# EAGLE design net-stepper2 (EAGLE 8.6.0)
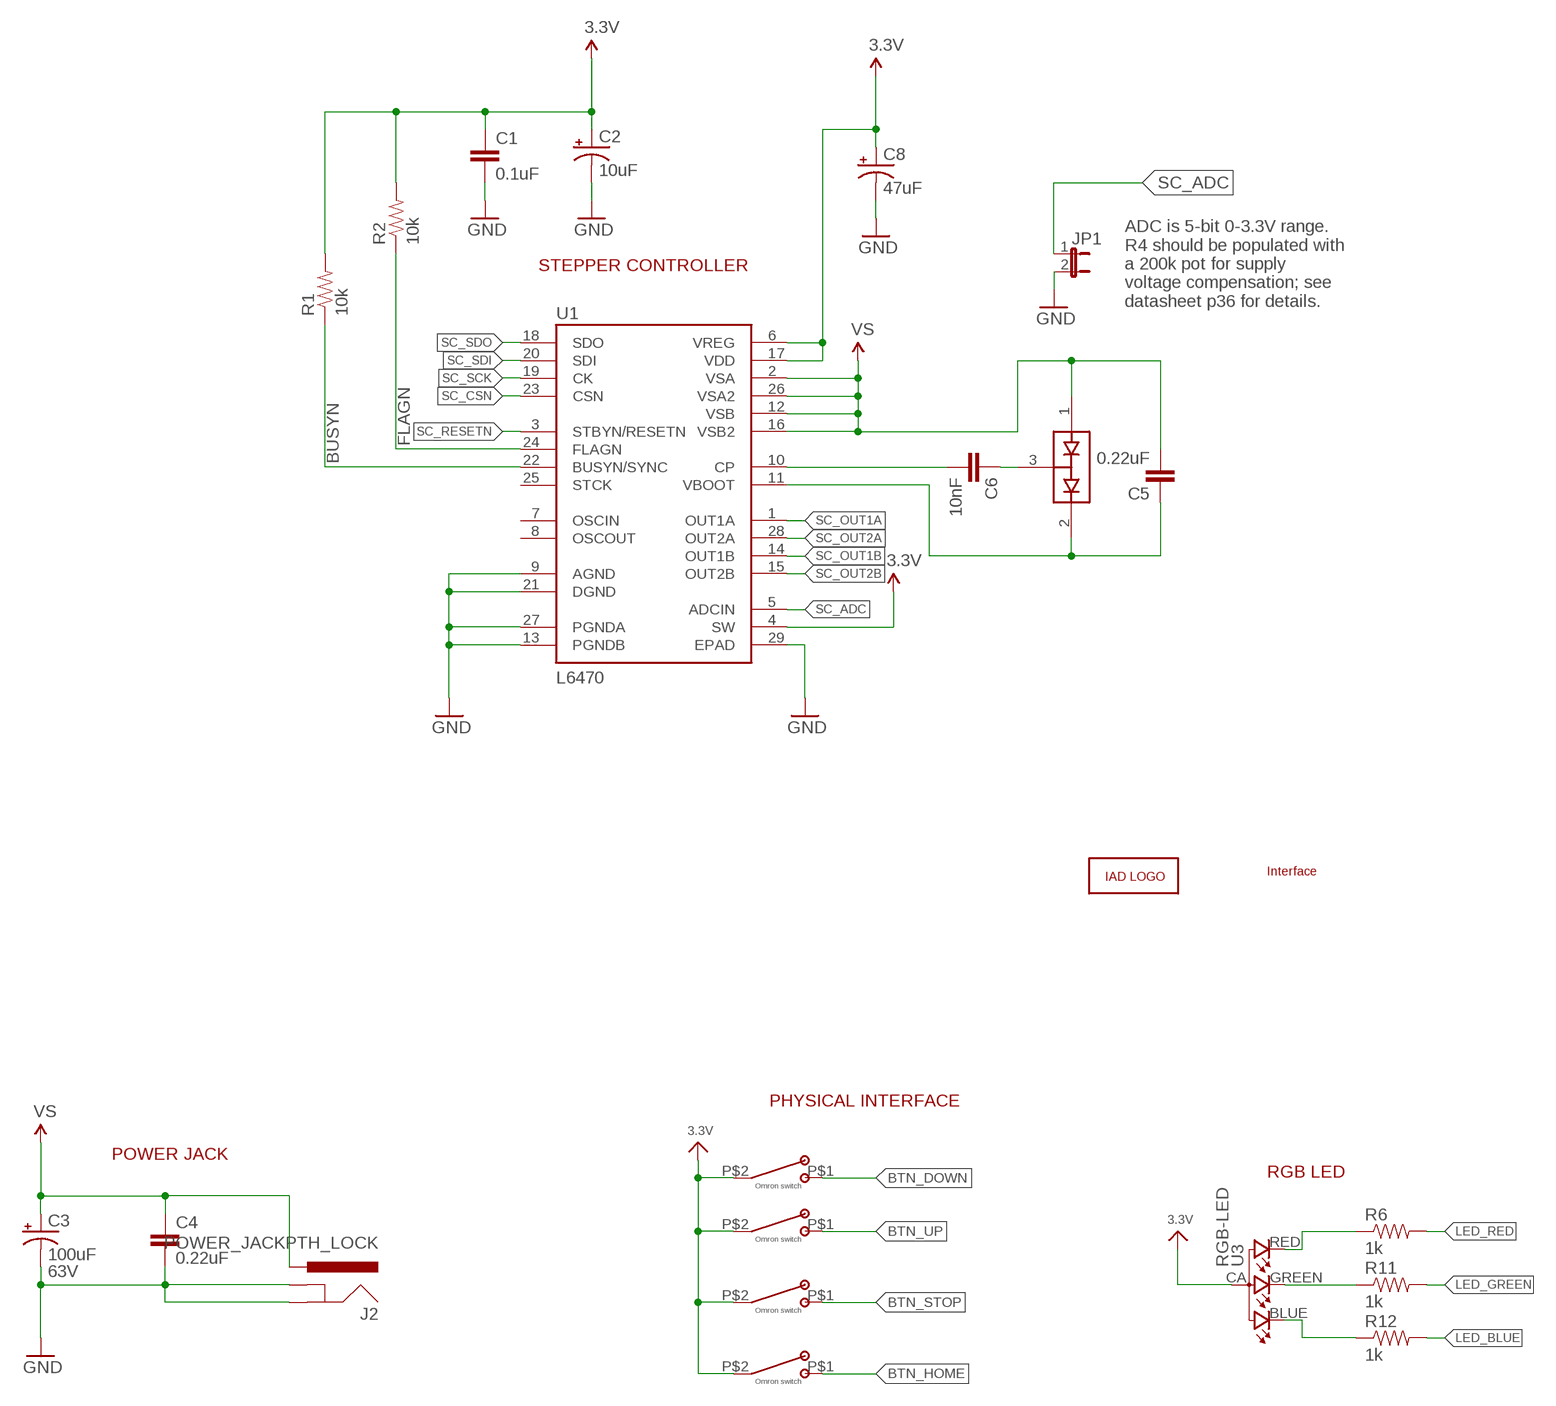
[diagram p0: schematic, sheet 1, part 1 of 2]
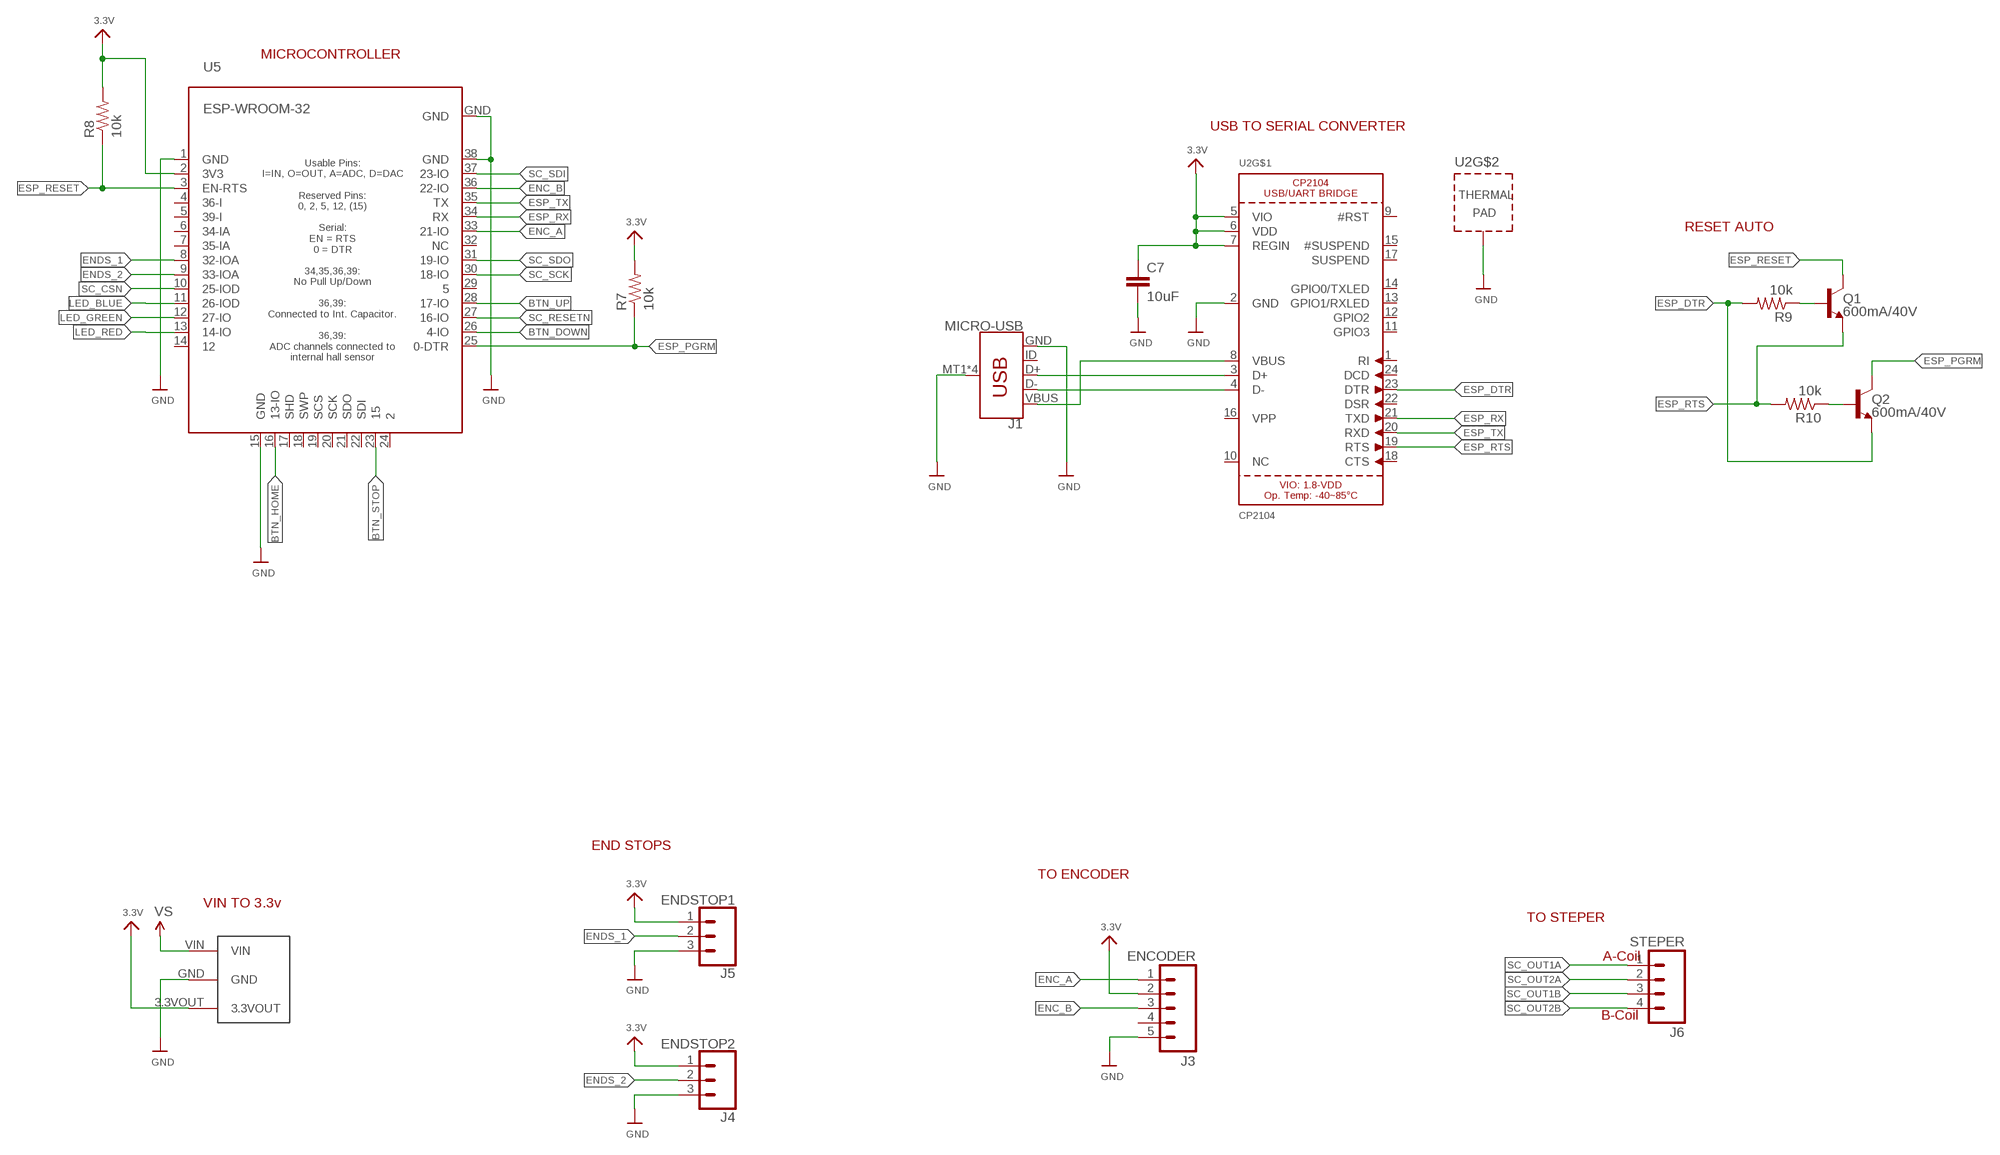
[diagram p1: schematic, sheet 1, part 2 of 2]

## Parts
A1  ZHDK_LOGO_METAL  [ZHDK_LOGO]
A2  INTERFACE_NETSTEPPER  [INTERFACE_NETSTEPPER]
C1  0.1uF  CAP0603-CAP  [0603-CAP]
C2  10uF  10UF-TANT  [EIA3216]
C3  100uF  100UF-63V-20%(ELECT)  [NIC_10X10.5_CAP]
C4  0.22uF  CAP0603-CAP  [0603-CAP]
C5  0.22uF  CAP0603-CAP  [0603-CAP]
C6  10nF  10NF/10000PF-50V-10%(0603)  [0603-CAP]
C7  10uF  10UF-0603-6.3V-20%  [0603]
C8  47uF  47UF-TANT  [EIA3528]
D1  BAV99  [SOT23-3@1]
J1  MICRO-USB  USB_MICRO-B_SMT  [USB-MICROB]
J2  POWER_JACKPTH_LOCK  [POWER_JACK_PTH_LOCK]
J3  ENCODER  M05PTH  [1X05]
J4  ENDSTOP2  CONN_03  [1X03]
J5  ENDSTOP1  CONN_03  [1X03]
J6  STEPER  M04LOCK_LONGPADS  [1X04_LOCK_LONGPADS]
JP1  JUMPER-2SMD-NC  [SJ_2S]
Q1  600mA/40V  TRANS_NPN-MMBT2222AL  [SOT23-3]
Q2  600mA/40V  TRANS_NPN-MMBT2222AL  [SOT23-3]
R1  10k  RESISTOR0603-RES  [0603-RES]
R2  10k  RESISTOR0603-RES  [0603-RES]
R6  1k  RESISTOR0603-RES  [0603-RES]
R7  10k  RESISTOR0603-RES  [0603-RES]
R8  10k  RESISTOR0603-RES  [0603-RES]
R9  10k  RESISTOR0603-RES  [0603-RES]
R10  10k  RESISTOR0603-RES  [0603-RES]
R11  1k  RESISTOR0603-RES  [0603-RES]
R12  1k  RESISTOR0603-RES  [0603-RES]
S1  B3AL-1002P-MS  [B3AL-1002P-MS]
S2  B3AL-1002P-MS  [B3AL-1002P-MS]
S3  B3AL-1002P-MS  [B3AL-1002P-MS]
S4  B3AL-1002P-MS  [B3AL-1002P-MS]
U1  L6470  L6470  [HTSSOP28]
U2  CP2104  [QFN24_4MM_SMSC]
U3  RGB-LED  RGB-LED-CLMVB-FKARGB  [PLCC4-2MM-RGB]
U4  TRACO12433  [TRACO12433]
U5  ESP-WROOM-32  [ESP-WROOM-32]

## Nets
3.3V: C1.1 C2.A(+) C7.1 C8.A(+) J3.2 J4.1 J5.1 R1.2 R2.2 R7.2 R8.2 S1.P$2 S2.P$2 S3.P$2 S4.P$2 U1.4(SW) U1.6(VREG) U1.17(VDD) U2.5(VIO) U2.6(VDD) U2.7(REGIN) U3.CA U4.3.3VOUT U5.2(3V3)
BTN_DOWN: S1.P$1 U5.26(4-IO)
BTN_HOME: S4.P$1 U5.16(13-IO)
BTN_STOP: S3.P$1 U5.23
BTN_UP: S2.P$1 U5.28(17-IO)
BUSYN: R1.1 U1.22(BUSYN/SYNC)
CP_HIGH: C6.1 D1.3(COM)
ENC_A: J3.1 U5.33(21-IO)
ENC_B: J3.3 U5.36(22-IO)
ENDS_1: J5.2 U5.8(32-IOA)
ENDS_2: J4.2 U5.9(33-IOA)
ESP_DTR: Q2.2(E) R9.2 U2.23(DTR)
ESP_PGRM: Q2.3(C) R7.1 U5.25(0-DTR)
ESP_RESET: Q1.3(C) R8.1 U5.3(EN-RTS)
ESP_RTS: Q1.2(E) R10.2 U2.19(RTS)
ESP_RX: U2.21(TXD) U5.34(RX)
ESP_TX: U2.20(RXD) U5.35(TX)
FLAGN: R2.1 U1.24(FLAGN)
GND: C1.2 C2.C(-) C3.- C4.2 C7.2 C8.C(-) J1.GND J1.MT1(SHIELD) J1.MT2(SHIELD) J1.P$1(SHIELD) J1.P$2(SHIELD) J2.GND J2.GNDBREAK J3.5 J4.3 J5.3 JP1.2 U1.9(AGND) U1.13(PGNDB) U1.21(DGND) U1.27(PGNDA) U1.29(EPAD) U2.2(GND) U2.THERM(TP) U4.GND U5.1(GND) U5.15(GND) U5.38(GND) U5.GND
LED_BLUE: R12.2 U5.11(26-IOD)
LED_GREEN: R11.2 U5.12(27-IO)
LED_RED: R6.2 U5.13(14-IO)
N$1: J1.VBUS U2.8(VBUS)
N$11: R11.1 U3.GREEN
N$12: R6.1 U3.RED
N$13: J1.D+ U2.3(D+)
N$14: J1.D- U2.4(D-)
N$20: R12.1 U3.BLUE
N$22: Q1.1(B) R9.1
N$23: Q2.1(B) R10.1
SC_ADC: JP1.1 U1.5(ADCIN)
SC_CSN: U1.23(CSN) U5.10(25-IOD)
SC_OUT1A: J6.1 U1.1(OUT1A)
SC_OUT1B: J6.3 U1.14(OUT1B)
SC_OUT2A: J6.2 U1.28(OUT2A)
SC_OUT2B: J6.4 U1.15(OUT2B)
SC_RESETN: U1.3(STBYN/RESETN) U5.27(16-IO)
SC_SCK: U1.19(CK) U5.30(18-IO)
SC_SDI: U1.20(SDI) U5.37(23-IO)
SC_SDO: U1.18(SDO) U5.31(19-IO)
V_BOOT: C5.1 D1.2(C2) U1.11(VBOOT)
V_CP: C6.2 U1.10(CP)
VS: C3.+ C4.1 C5.2 D1.1(A1) J2.PWR U1.2(VSA) U1.12(VSB) U1.16(VSB2) U1.26(VSA2) U4.VIN
Unconnected: J1.ID J3.4 U1.7(OSCIN) U1.8(OSCOUT) U1.25(STCK) U2.1(RI) U2.9(#RST) U2.10(NC) U2.11(GPIO3) U2.12(GPIO2) U2.13(GPIO1/RXLED) U2.14(GPIO0/TXLED) U2.15(#SUSPEND) U2.16(VPP) U2.17(SUSPEND) U2.18(CTS) U2.22(DSR) U2.24(DCD) U5.4(36-I) U5.5(39-I) U5.6(34-IA) U5.7(35-IA) U5.14 U5.17(SHD) U5.18(SWP) U5.19(SCS) U5.20(SCK) U5.21(SDO) U5.22(SDI) U5.24 U5.29 U5.32(NC)

## Notes on the sheet
- FIX: External power requirement to flash the device. Actually, the esp32 is powered somehow through the usb bridge...
- MICROCONTROLLER
- USB TO SERIAL CONVERTER
- STEPPER CONTROLLER
- ADC is 5-bit 0-3.3V range.
  R4 should be populated with
  a 200k pot for supply
  voltage compensation; see
  datasheet p36 for details.
- RESET AUTO
- PHYSICAL INTERFACE
- END STOPS
- POWER JACK
- RGB LED | TO ENCODER
- VIN TO 3.3v
- TO STEPER
- 63V | A-Coil
- B-Coil

## Library data of the parts
A1 = IAD_GRAPHIC:ZHDK_LOGO_METAL
A2 = IAD_GRAPHIC:INTERFACE_NETSTEPPER
C1 C4 C5 = SparkFun-Passives:CAP: Capacitor Standard 0603 ceramic capacitor, and 0.1" leaded capacitor.
C2 = SparkFun-Capacitors:10UF-TANT: 10uF Tantalum SMT CAP-00811- 16V 10% (EIA-3216); PROD_ID: CAP-00811
C3 = SparkFun-Capacitors:100UF-63V-20%(ELECT): CAP-08362 100uF electrolytic SMT 63V 20%; PROD_ID: CAP-08362
C6 = SparkFun-Capacitors:10NF/10000PF-50V-10%(0603): CAP-00867; PROD_ID: CAP-00867
C7 = SparkFun-Capacitors:10UF: 10.0µF ceramic capacitors A capacitor is a passive two-terminal electrical component used to store electrical energy temporarily in an electric field.; PROD_ID: CAP-11015
C8 = SparkFun-Capacitors:47UF-TANT: 47uF Tantalum SMT CAP-08310- 10V 10% (EIA-3528); PROD_ID: CAP-08310
D1 = SparkFun-DiscreteSemi:BAV99: Two small signal silicon diodes connected anode to cathode. Connections to all three nodes available. DIO-10647; PROD_ID: DIO-10647
J1 = SparkFun-Connectors:USB_MICRO-B: USB Type Micro-B Connector Male/female and PTH/SMT variants SparkFun Products: SparkFun microB USB Breakout <https://www.sparkfun.com/products/12035> SparkFun USB microB Plug Breakout <https://www.sparkfun.com/products/10031> SparkFun ESP8266 Thing <https://www.sparkfun.com/products/13231>; PROD_ID: CONN-09505; SF_ID: PRT-08533
J2 = SparkFun-Connectors:POWER_JACK: Power Jack This is the standard 5.5mm barrel jack for power. The PTH is the most common, proven, reliable, footprint. The Slot footprint only works if the mill layer is transmitted to the PCB fab house so be warned. Mating wall wart : TOL-00298 (and others); PROD_ID: CONN-08197; SF_ID: PRT-00119
J3 = SparkFun-Connectors:M05: Header 5 Standard 5-pin 0.1" header. Use with straight break away headers (SKU : PRT-00116), right angle break away headers (PRT-00553), swiss pins (PRT-00743), machine pins (PRT-00117), and female headers (PRT-00115). Molex polarized connector foot print use with SKU : PRT-08230 with associated crimp pins and housings.
J4 J5 = SparkFun-Connectors:CONN_03: Multi connection point. Often used as Generic Header-pin footprint for 0.1 inch spaced/style header connections On any of the 0.1 inch spaced packages, you can populate with these: Break Away Headers - Straight <https://www.sparkfun.com/products/116> (PRT-00116) Break Away Male Headers - Right Angle <https://www.sparkfun.com/products/553> (PRT-00553) Female Headers <https://www.sparkfun.com/products/115> (PRT-00115) Break Away Headers - Machine Pin <https://www.sparkfun.com/products/117> (PRT-00117) Break Away Female Headers - Swiss Machine Pin <https://www.sparkfun.com/products/743> (PRT-00743) Stackable Header - 3 Pin (Female, 0.1") <https://www.sparkfun.com/products/13875> (PRT-13875) For SCREWTERMINALS and SPRING TERMINALS visit here: Screw Terimnals on SparkFun.com <https://www.sparkfun.com/search/results?term=Screw+Terminals> (5mm/3.5mm/2.54mm spacing) This device is also useful as a general connection point to wire up your design to another part of your project. Our various solder wires solder well into these plated through hole pads. Hook-Up Wire - Assortment (Stranded, 22 AWG) <https://www.sparkfun.com/products/11375> (PRT-11375) Hook-Up Wire - Assortment (Solid Core, 22 AWG) <https://www.sparkfun.com/products/11367> (PRT-11367) View the entire wire category on our website here <https://www.sparkfun.com/categories/141> Special notes: Molex polarized connector foot print use with SKU : PRT-08232 with associated crimp pins and housings.
J6 = SparkFun-Connectors:M04: Header 4 Standard 4-pin 0.1" header. Use with straight break away headers (SKU : PRT-00116), right angle break away headers (PRT-00553), swiss pins (PRT-00743), machine pins (PRT-00117), and female headers (PRT-00115). Molex polarized connector foot print use with SKU : PRT-08231 with associated crimp pins and housings. 1MM SMD Version SKU: PRT-10208; PROD_ID: CONN-09696
JP1 = RP400N501A:JUMPER-2: Jumper Basic 0.1" spaced jumper. Use with breakaway headers.
Q1 Q2 = SparkFun-DiscreteSemi:TRANS_NPN: NPN transistor Current controlled devices typically used to amplify current or used as a switch. BC547 - COM-08928 <http://www.sparkfun.com/products/8928> (TO-92 45V 100mA) (1.Collector 2.Base 3.Emitter) 2N3904 - COM-00521 <http://www.sparkfun.com/products/521> (TO-92 40V 200mA) (1.Emitter 2.Base 3.Collector) P2N2222A - COM-12852 <http://www.sparkfun.com/products/12852> (TO-92 40V 600mA) (1.Collector 2.Base 3.Emitter); PROD_ID: TRANS-08049
R1 R2 R6-R12 = SparkFun-Passives:RESISTOR: Resistor Basic schematic elements and footprints for 0603, 1206, and PTH resistors.
S1-S4 = IAD-Library:B3AL-1002P-MS
U1 = SparkFun-PowerIC:L6470: 3A RMS/7A peak bipolar stepper motor driver with SPI control and step input in HTSSOP-28 package. IC-10648; PROD_ID: IC-10648
U2 = microbuilder:CP2104: CP2104 - USB to UART Bridge VDD Output: 3.45V
U3 = Particle:RGB-LED-CLMVB-FKA: CREE CLMVB-FKA RGB LED 2mm x 2mm
U4 = IAD_ZHDK:TRACO12433
U5 = esp32:ESP-WROOM-32

## Board
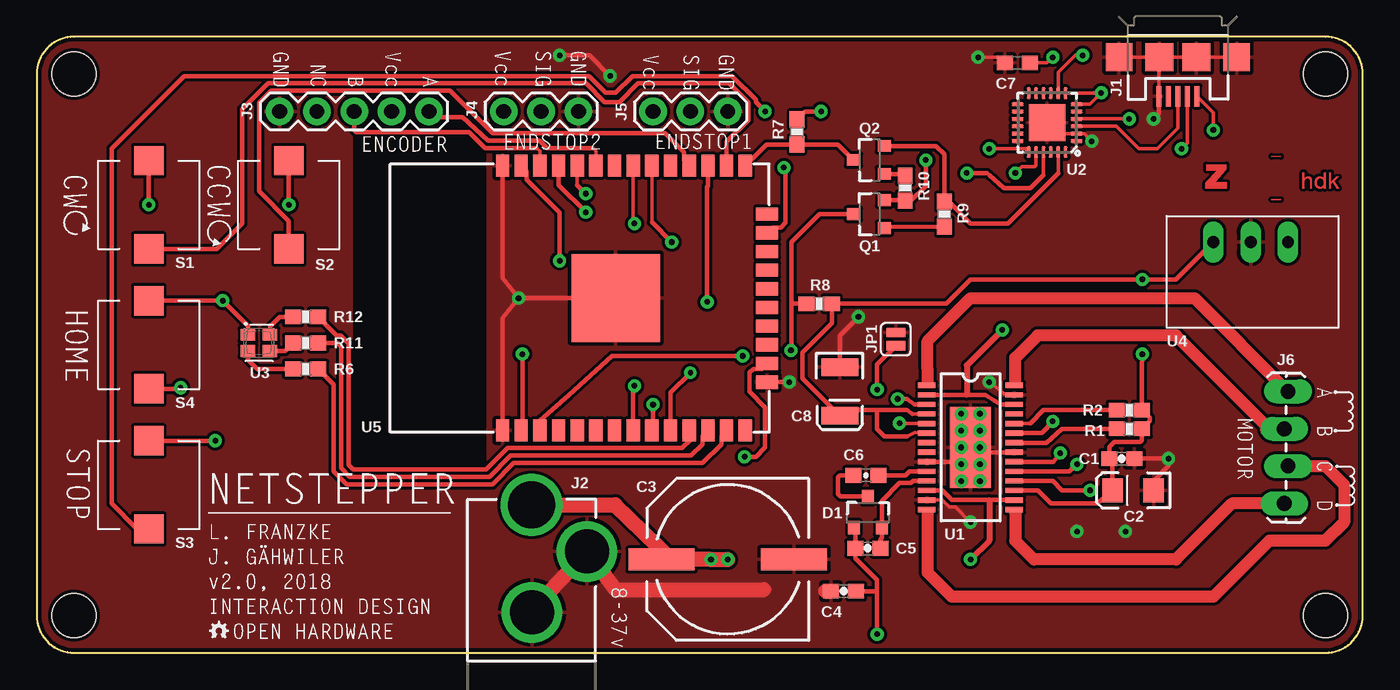
[diagram p2: board, top side]
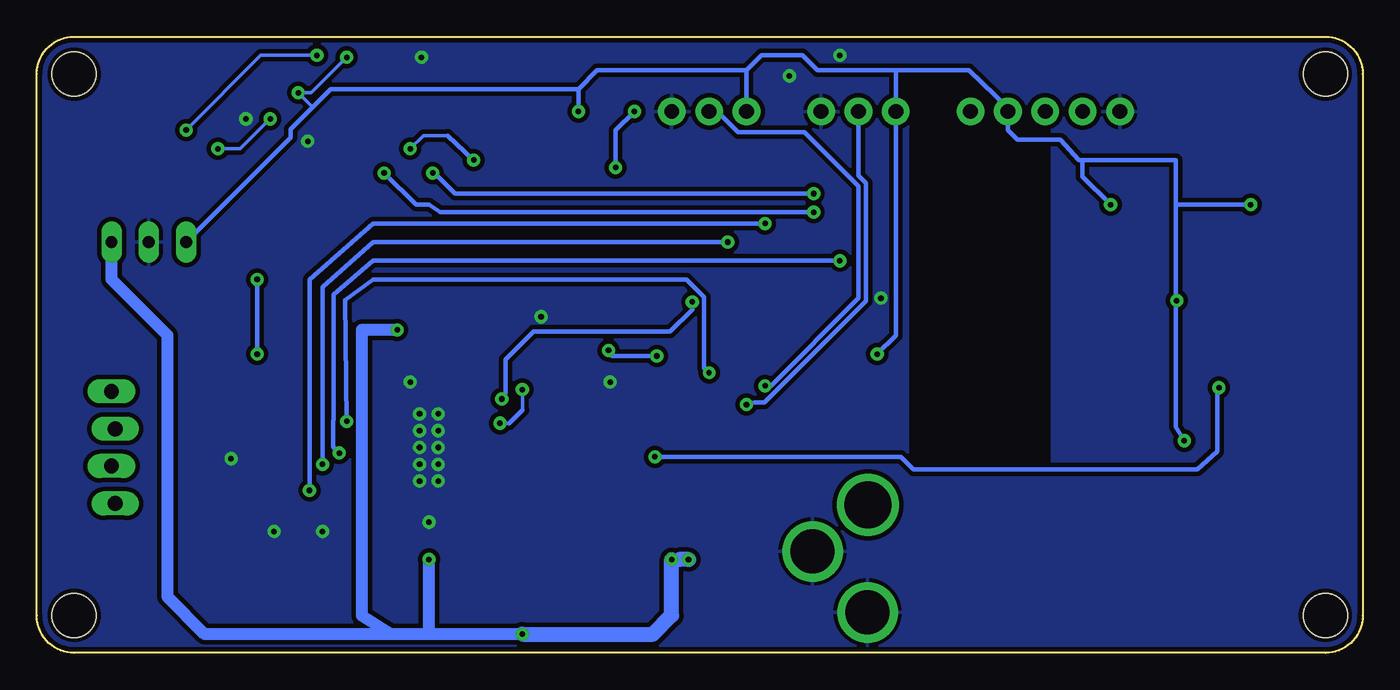
[diagram p3: board, bottom side, seen from below]

Size 90.17 x 41.91 mm. Coordinates in mm from the lower left corner, seen from the top.
Outline: 2.54,0 87.63,0 arc90 90.17,2.54 90.17,39.37 arc90 87.63,41.91 2.54,41.91 arc90 0,39.37 0,2.54 arc90 2.54,0
Copper layers (1*16): Top 0.035mm / dielectric 1.5mm / Bottom 0.035mm
Design rules "SparkFun *": minimum track width 8mil, minimum drill 15mil, track to track 8mil, track to pad 12mil, pad to pad 8mil, via to via 16mil, smd to smd 8mil, copper to edge 10mil, drill to drill 8mil, minimum pad ring 12mil, minimum via ring 10mil, stop-mask expansion 4mil, vias tented up to drill 25mil, thermal gap 10mil
Holes 3 mm at 2.54,39.37 2.54,2.54 87.63,2.54 87.63,39.37

### Footprints (pad centres in the part's own frame; a part is rotated, then mirrored left to right if it is on the bottom)
0603-CAP = smd 1.1 x 1: 1 -0.85,0; 2 0.85,0
EIA3216 = smd 1.4 x 1.6: A 1.4,0; C -1.4,0
NIC_10X10.5_CAP = smd 4.5 x 1.5: + 4.5,0; - -4.5,0
0603 = smd 1.1 x 1: 1 -0.85,0; 2 0.85,0
EIA3528 = smd 1.2 x 2.5: A 1.65,0; C -1.65,0
SOT23-3@1 = smd 0.8 x 0.9: 1 -0.95,-1; 2 0.95,-1; 3 0,1.1
USB-MICROB = smd 1.4 x 0.35: D+ -2.65,0; D- -2.65,-0.65; GND -2.65,1.3; ID -2.65,0.65; VBUS -2.65,-1.3 | smd 1.9 x 1.8: MT1 0,-4; MT2 0,4 | smd 1.9 x 1.9: P$1 0,-1.27; P$2 0,1.27
POWER_JACK_PTH_LOCK = drill 2.997 pad 4.115: GND 0.025,6.557; GNDBREAK 3.762,10.7 | drill 3.2 pad 4.115: PWR 0,13.878
1X05 = drill 1.016 pad 1.88: 1 0,0; 2 2.54,0; 3 5.08,0; 4 7.62,0; 5 10.16,0
1X03 = drill 1.016 pad 1.88: 1 0,0; 2 2.54,0; 3 5.08,0
1X04_LOCK_LONGPADS = drill 1.016 long: 1 0,0; 2 2.54,-0.254; 3 5.08,0; 4 7.62,-0.254
SJ_2S = smd 0.635 x 1.27: 1 -0.45,0; 2 0.45,0
SOT23-3 = smd 0.8 x 0.9: 1 -0.95,-1; 2 0.95,-1; 3 0,1.1
0603-RES = smd 1.1 x 1: 1 -0.85,0; 2 0.85,0
B3AL-1002P-MS = smd 2 x 2: P$1 -3,0; P$2 3,0
HTSSOP28 = smd 0.36 x 1.19: 1 -4.225,-2.97; 2 -3.575,-2.97; 3 -2.925,-2.97; 4 -2.275,-2.97; 5 -1.625,-2.97; 6 -0.975,-2.97; 7 -0.325,-2.97; 8 0.325,-2.97; 9 0.975,-2.97; 10 1.625,-2.97; 11 2.275,-2.97; 12 2.925,-2.97; 13 3.575,-2.97; 14 4.225,-2.97; 15 4.225,2.97; 16 3.575,2.97; 17 2.925,2.97; 18 2.275,2.97; 19 1.625,2.97; 20 0.975,2.97; 21 0.325,2.97; 22 -0.325,2.97; 23 -0.975,2.97; 24 -1.625,2.97; 25 -2.275,2.97; 26 -2.925,2.97; 27 -3.575,2.97; 28 -4.225,2.97 | smd 5.5 x 2.8: 29 0,0
QFN24_4MM_SMSC = smd 0.8 x 0.28: 1 -2,1.25; 2 -2,0.75; 3 -2,0.25; 4 -2,-0.25; 5 -2,-0.75; 6 -2,-1.25; 13 2,-1.25; 14 2,-0.75; 15 2,-0.25; 16 2,0.25; 17 2,0.75; 18 2,1.25 | smd 0.28 x 0.8: 7 -1.25,-2; 8 -0.75,-2; 9 -0.25,-2; 10 0.25,-2; 11 0.75,-2; 12 1.25,-2; 19 1.25,2; 20 0.75,2; 21 0.25,2; 22 -0.25,2; 23 -0.75,2; 24 -1.25,2 | smd 2.5 x 2.5: THERM 0,0
PLCC4-2MM-RGB = smd 1 x 0.8: BLUE -0.75,-0.55; CA 0.75,-0.55; GREEN -0.75,0.55; RED 0.75,0.55
TRACO12433 = drill 0.8 long: 3.3VOUT 0,-2.54; GND 0,0; VIN 0,2.54
ESP-WROOM-32 = smd 0.9 x 1.5: 1 7.7,9; 2 6.43,9; 3 5.16,9; 4 3.89,9; 5 2.62,9; 6 1.35,9; 7 0.08,9; 8 -1.19,9; 9 -2.46,9; 10 -3.73,9; 11 -5,9; 12 -6.27,9; 13 -7.54,9; 14 -8.81,9; 25 -8.81,-9; 26 -7.54,-9; 27 -6.27,-9; 28 -5,-9; 29 -3.73,-9; 30 -2.46,-9; 31 -1.19,-9; 32 0.08,-9; 33 1.35,-9; 34 2.62,-9; 35 3.89,-9; 36 5.16,-9; 37 6.43,-9; 38 7.7,-9 | smd 1.5 x 0.9: 15 -10.3,5.715; 16 -10.3,4.445; 17 -10.3,3.175; 18 -10.3,1.905; 19 -10.3,0.635; 20 -10.3,-0.635; 21 -10.3,-1.905; 22 -10.3,-3.175; 23 -10.3,-4.445; 24 -10.3,-5.715 | smd 6 x 6: GND 0,0

### Placement (x,y rotation side)
A1  78.74,33.78 0 top
A2  2.54,39.37 270 top
C1  73.79,13.21 0 top
C2  74.55,11.05 180 top
C3  46.99,6.35 180 top
C4  54.86,4.19 180 top
C5  56.52,7.11 180 top
C6  56.39,12.06 0 top
C7  66.67,40.13 180 top
C8  54.61,17.78 270 top
D1  56.52,9.53 0 top
J1  77.6,40.51 90 top
J2  33.66,-3.81 0 top
J3  26.67,36.83 180 top
J4  31.75,36.83 0 top
J5  41.91,36.83 0 top
J6  85.09,17.78 270 top
JP1  58.42,21.34 90 top
Q1  56.64,29.84 90 top
Q2  56.64,33.53 90 top
R1  74.3,15.24 0 top
R2  74.3,16.51 0 top
R6  18.29,19.3 0 top
R7  51.69,35.43 90 top
R8  53.21,23.75 0 top
R9  61.72,29.84 90 top
R10  59.05,31.62 270 top
R11  18.29,21.08 0 top
R12  18.29,22.86 0 top
S1  7.62,30.48 90 top
S2  17.14,30.48 90 top
S3  7.62,11.43 90 top
S4  7.62,20.95 90 top
U1  63.5,13.97 270 top
U2  68.71,36.07 180 top
U3  15.11,21.08 180 top
U4  82.55,27.94 270 top
U5  39.37,24.13 180 top

### Tracks (layer width: path | path; a pad name or v marks a point on that pad's centre or on a via)
3.3V  (via drill 0.38)
  Top 0.254: 59.56,16.26 59.95,16.25 U1.4 | U1.6 59.73,14.99 59.18,14.73 | C2.A | 73.15,13 C1.1 | R2.2 75.4,16.26 75.56,16.26 | U5.2 33.02,15.21 | C8.A 54.61,16.51 | 72.36,38.07 71.61,37.32 U2.6 U2.5 | U2.7 72.36,38.07 | 72.36,38.07 v72.39,38.1 71.88,38.1 | C7.1 68.71,40.13 v69.09,40.51
  Top 0.305: 57.15,16.51 59.18,16.51 59.56,16.26 | 59.18,14.73 57.66,14.73 57.15,15.24 57.15,16.51 | U1.17 68.07,11.05 68.97,10.16 72.14,10.16 C2.A | C2.A 73.15,13 | C1.1 72.94,14.01 73.28,14.35 75.06,14.35 75.14,14.44 R1.2 75.69,15.79 75.69,16 75.56,16.13 75.56,16.26 | 54.61,16.51 57.15,16.51 | U4.3.3VOUT 77.47,25.4 v75.18,25.4 63.5,25.4 61.85,23.75 R8.2 54.06,22.44 52.07,20.45 52.07,18.67 C8.A | R2.2 75.14,19.34 v75.18,20.32 | S3.P$2 v12.14,14.43 | S4.P$2 v12.65,23.95 14.36,22.24 U3.CA 14.32,21.59 | 33.02,15.21 v33.02,20.32 | R7.2 52.24,36.83 v53.34,36.83 | S1.P$2 v7.62,30.48 | S2.P$2 v17.14,30.48
  Bottom 0.254: 71.42,37.13 v72.39,38.1 71.5,38.1 v69.09,40.51 | 12.7,22.86 12.7,23.91 v12.65,23.95
  Bottom 0.305: v75.18,20.32 v75.18,25.4 | J5.1 41.91,39.62 | 31.75,39.62 26.8,39.62 24.13,37.08 J3.2 24.13,35.56 23.5,34.92 20.57,34.92 19.3,33.53 19.05,33.53 | 53.34,38.35 52.07,39.62 41.91,39.62 | v12.14,14.43 12.7,15.37 12.7,22.86 12.7,30.48 | 12.7,30.48 12.7,33.53 19.05,33.53 | v33.02,20.32 31.75,21.59 J4.1 31.75,39.62 | U4.3.3VOUT 72.92,35.03 72.92,35.63 71.42,37.13 70.2,38.35 53.34,38.35 | v53.34,36.83 53.34,38.35 | v7.62,30.48 12.7,30.48 | v17.14,30.48 19.05,32.38 19.05,33.53 | 31.75,39.62 37.08,39.62 38.1,40.64 40.89,40.64 41.91,39.62
BTN_DOWN
  Top 0.305: U5.26 46.91,34.77 48.39,36.25 48.39,37.41 47.06,38.73 40.89,38.73 39.62,37.47 38.61,37.47 37.34,38.73 15.72,38.73 13.97,36.98 13.97,29.21 12.24,27.48 S1.P$1
BTN_HOME  (via drill 0.38)
  Top 0.305: U5.16 49.31,19.32 48.73,19.32 48.46,19.05 48.46,17.78 49.53,16.71 49.53,13.97 48.9,13.34 v48.13,13.34 | v9.78,18.03 9.7,17.95 S4.P$1
  Bottom 0.305: v48.13,13.34 31.42,13.34 30.57,12.48 11.27,12.48 9.91,13.72 9.91,17.91 v9.78,18.03
BTN_STOP  (via drill 0.38)
  Top 0.305: U5.23 50.03,28.94 50.61,28.94 50.93,29.25 50.93,32.77 50.8,32.89 v50.8,33.02 | v49.53,36.83 48.9,37.47 48.9,37.62 47.27,39.24 40.51,39.24 39.37,38.1 38.69,38.1 37.55,39.24 10.03,39.24 5.08,34.29 5.08,10.16 6.81,8.43 S3.P$1
  Bottom 0.305: v50.8,33.02 50.8,35.56 v49.53,36.83
BTN_UP
  Top 0.305: U5.28 44.01,33.49 44.01,34.07 42.72,35.35 30.99,35.35 28.12,38.23 15.93,38.23 15.11,37.41 15.11,31.4 17.14,29.37 S2.P$1
BUSYN
  Top 0.203: 73.15,15.24 73.03,15.24
  Top 0.254: R1.1 73.15,15.24
  Top 0.305: U1.22 68.65,14.29 69.72,15.24 73.15,15.24
CP_HIGH
  Top 0.305: D1.3 54.65,10.62 54.48,10.79 54.48,11.94 54.61,12.06 C6.1
ENC_A
  Top 0.254: U5.33 38.02,34.12 37.8,34.34
  Top 0.305: J3.1 27.05,36.45 28.96,36.45 30.69,34.84 34.2,34.84 34.71,34.34 37.8,34.34
ENC_B
  Top 0.254: U5.36 34.21,34.12 33.99,34.34
  Top 0.305: 33.99,34.34 30.48,34.34 29.38,35.43 21.72,35.43 21.59,35.56 J3.3
ENDS_1  (via drill 0.38)
  Top 0.305: U5.8 40.56,18.21 40.64,18.29 40.65,18.28 v40.65,18.17
  Bottom 0.305: J5.2 43.89,36.83 42.49,35.43 37.97,35.43 34.29,31.75 34.29,24.13 40.25,18.17 v40.65,18.17
ENDS_2  (via drill 0.38)
  Top 0.305: 34.21,36.75 J4.2 | U5.9 41.91,15.21 v41.91,16.89
  Bottom 0.305: J4.2 34.29,32.47 33.78,31.96 33.78,23.92 40.68,17.02 41.36,17.02 41.87,16.89 v41.91,16.89
ESP_DTR
  Top 0.254: 62.02,30.7 R9.2 | U2.23 69.46,32.63
  Top 0.305: R9.2 61.72,33.91 61.15,34.48 Q2.2 | 62.02,30.7 63.5,29.21 66.04,29.21 69.46,32.63
ESP_PGRM
  Top 0.305: Q2.3 54.49,34.58 R7.1 49.63,34.58 U5.25
ESP_RESET  (via drill 0.38)
  Top 0.254: U5.3 34.21,15.79
  Top 0.305: 51.31,23.75 51.31,27.94 53.21,29.84 Q1.3 | 34.21,15.79 36.2,17.53 39.12,20.19 v48.01,20.19 | 51.31,23.75 R8.1 | 51.31,23.75 51.31,20.6 v51.28,20.57
  Bottom 0.305: v48.01,20.19 51.05,20.19 51.31,20.45 51.28,20.47 v51.28,20.57
ESP_RTS  (via drill 0.38)
  Top 0.254: U2.19 67.23,34.29 v64.77,34.29
  Top 0.305: 58.98,30.8 Q1.2 | R10.2 59.42,30.72 60.45,31.75 v60.45,33.53
  Top 0.406: R10.2 58.98,30.8
  Bottom 0.254: 62.23,35.18 63.88,35.18 v64.77,34.29
  Bottom 0.305: v60.45,33.53 62.23,35.18
ESP_RX  (via drill 0.38)
  Top 0.254: U5.34 36.75,31.83 | U2.21 68.46,32.52 68.45,32.51
  Top 0.305: 36.75,31.83 v37.34,31.24 | 68.45,32.51 67.56,31.62 65.76,31.62 64.77,32.49 64.62,32.64 v63.25,32.64
  Bottom 0.305: v37.34,31.24 61.72,31.24 63.12,32.64 v63.25,32.64
ESP_TX  (via drill 0.38)
  Top 0.254: U2.20 67.96,33.16 67.87,33.07 66.98,33.07 66.8,32.89
  Top 0.305: v37.34,29.97 35.48,31.83 U5.35 | 66.8,32.89 v66.55,32.64
  Bottom 0.305: v37.34,29.97 62.74,29.97 63.5,30.48 64.39,30.48 v66.55,32.64
FLAGN
  Top 0.254: 67.56,15.62 67.54,15.6 U1.24
  Top 0.305: R2.1 68.45,16.51 67.56,15.62
GND  (via drill 0.38)
  Top 0.254: 75.69,11.31 C2.C | U1.27 65.89,17.55 v64.77,18.41 | U1.13 61.57,10.39 62.05,9.91 62.48,9.91 v63.5,8.89 | 62.82,13.29 62.82,12.99 | U1.29 63.83,13.64 64.59,13.64 | J1.GND 76.3,40.48 J1.P$2 | J1.P$2 J1.MT2 | J1.P$2 J1.P$1 J1.MT1 | v71.74,34.8 71.75,34.8 71.23,35.32 U2.2 69.73,35.32 69.72,35.31 68.96,36.07 U2.THERM | C7.2 65.44,40.51 v64.01,40.51
  Top 0.305: C8.C 54.61,21.59 v55.88,22.86 | C2.C 75.95,11.69 76.96,12.7 v76.96,13.21 C1.2 | 64.59,13.64 U1.21 | U1.9 62.82,12.99 v62.87,12.83 | J1.GND 76.3,36.67 v75.95,36.32 | U5.GND v32.77,24.13 | U5.1 31.67,22.78 v32.77,24.13 | v32.77,24.13 31.67,25.48 U5.38 | U5.15 v51.18,18.41 49.53,18.41 | v38.99,39.24 37.59,40.64 v35.56,40.64
  Top 1.016: J2.GND 33.93,3.15 J2.GNDBREAK 39.37,4.3 49.44,4.3 | 53.65,4.19 C4.2
  other vias: 62.87,16.26 64.14,16.26 62.87,15.11 64.14,15.11 62.87,13.97 64.14,11.68 62.87,11.68 64.14,12.83 64.14,13.97 70.74,8.26 74.04,8.26
  pour Bottom (isolate 0.305, rank 3): -1.27,43.18 -1.27,-1.27 91.44,-1.27 91.44,43.18
  pour Bottom (isolate 0.305): 59.69,7.62 59.69,20.32 67.31,20.32 67.31,7.62
  pour Top: 92.71,44.45 92.71,-2.54 -2.54,-2.54 -2.54,44.45
LED_BLUE
  Top 0.305: R12.2 20.41,21.59 20.66,21.59 21.21,21.04 21.21,12.78 21.5,12.48 30.57,12.48 32.01,13.92 43.9,13.92 44.45,14.48 44.37,14.56 U5.11
LED_GREEN
  Top 0.305: U5.12 45.28,14.77 45.28,14.19 44.5,13.41 32.22,13.41 30.78,11.98 21.29,11.98 20.7,12.56 20.7,20.83 20.45,21.08 R11.2
LED_RED
  Top 0.305: 19.54,18.91 R6.2 20.19,18.25 20.19,12.36 21.08,11.47 30.99,11.47 32.43,12.91 45.26,12.91 46.55,14.19 46.55,14.77 U5.13
N$1  (via drill 0.38)
  Top 0.254: J1.VBUS 80.01,36.75 v80.01,35.56 | v71.12,40.64 70.61,40.64 69.46,39.48 U2.8
  Bottom 0.254: v80.01,35.56 74.93,40.64 v71.12,40.64
N$11
  Top 0.305: R11.1 16.89,20.53 U3.GREEN
N$12
  Top 0.305: R6.1 14.99,19.3 14.35,19.94 14.36,19.95 U3.RED
N$13
  Top 0.254: J1.D+ 77.6,35.69 76.2,34.29 74.93,34.29 73.4,35.82 U2.3
N$14  (via drill 0.38)
  Top 0.254: 74.16,36.32 74.17,36.32 v74.3,36.32 U2.4 | J1.D- 78.25,34.69 v77.85,34.29
  Bottom 0.254: v74.3,36.32 76.33,34.29 v77.85,34.29
N$20
  Top 0.305: R12.1 16.51,22.86 15.86,22.21 U3.BLUE
N$22
  Top 0.305: R9.1 57.69,28.95 Q1.1
N$23
  Top 0.305: Q2.1 59,32.58
  Top 0.406: 59,32.58 R10.1
SC_ADC  (via drill 0.38)
  Top 0.254: U1.5 60.5,15.62 v58.67,15.62
  Top 0.305: v57.15,17.91 57.15,19.62 JP1.1
  Bottom 0.254: v58.67,15.62 58.04,15.62 | 57.15,16.51 v57.15,17.91
  Bottom 0.305: 58.04,15.62 57.15,16.51
SC_CSN  (via drill 0.35, 0.38)
  Top 0.305: U1.23 68.37,14.95 v69.09,15.75 | U5.10 43.1,17.7 v44.45,19.05
  Bottom 0.305: v69.09,15.75 69.22,24 67.31,25.4 45.97,25.4 45.72,25.14 44.79,24.21 44.79,19.39 v44.45,19.05
SC_OUT1A
  Top 0.254: 60.53,19.25 60.58,19.3
  Top 0.305: 60.58,18.41 60.66,18.37 U1.1
  Top 0.813: J6.1 78.74,24.13 63.5,24.13 60.58,21.21 60.58,19.3 60.58,18.41
SC_OUT1B
  Top 0.305: U1.14 60.58,9.44
  Top 0.813: J6.3 87.63,12.7 88.9,11.43 88.9,8.89 87.63,7.62 83.82,7.62 80.01,3.81 62.23,3.81 60.58,5.46 60.58,9.44
SC_OUT2A
  Top 0.305: U1.28 66.55,18.27 66.55,18.41
  Top 0.813: 83.82,15.24 77.47,21.59 68.07,21.59 66.55,20.07 66.55,18.41
  Top 1.27: J6.2 83.82,15.24
SC_OUT2B
  Top 0.305: U1.15 66.55,9.54
  Top 0.813: J6.4 81.28,10.16 77.47,6.35 67.82,6.35 66.55,7.62 66.55,9.54
SC_RESETN  (via drill 0.38)
  Top 0.254: 45.64,31.75 45.59,31.7
  Top 0.305: U1.3 59.94,16.89 59.69,16.89 59.18,17.27 v58.55,17.27 | 45.59,31.7 v45.59,23.88 | U5.27 45.64,31.75
  Bottom 0.305: v58.55,17.27 58.29,17.65 58.29,19.94 56.39,21.84 47.12,21.84 45.59,23.37 v45.59,23.88
SC_SCK  (via drill 0.38)
  Top 0.254: U5.30 41.83,29.29
  Top 0.305: U1.19 70.2,12.35 v70.74,12.83 | 41.83,29.29 v43.18,27.94
  Bottom 0.305: v70.74,12.83 70.74,24.89 67.31,27.94 v43.18,27.94
SC_SDI  (via drill 0.38)
  Top 0.305: U1.20 69.13,12.99 v69.6,13.59 | U5.37 33.3,32.77 33.3,32.19 35.56,29.93 v35.56,26.67
  Bottom 0.305: v35.56,26.67 67.31,26.67 69.98,24.38 69.98,15.84 70,15.82 70,13.99 69.87,13.87 v69.6,13.59
SC_SDO  (via drill 0.38)
  Top 0.254: U5.31 40.56,29.29 v40.64,29.21
  Top 0.305: v71.63,11.05 69.72,11.05 69.09,11.68 68.57,11.7 U1.18
  Bottom 0.305: v71.63,11.05 71.63,25.4 67.31,29.21 v40.64,29.21
V_BOOT
  Top 0.305: U1.11 59.57,11.7 59.44,11.56 58.67,11.56 57.47,10.35 D1.2 57.47,7.81 57.37,7.71 C5.1
V_CP
  Top 0.305: U1.10 59.34,12.35 59.05,12.06 C6.2
VS  (via drill 0.38)
  Top 0.254: 65.91,16.89 U1.26
  Top 0.305: U1.2 63.25,17.55 64.5,17.55 65.15,17.14 65.53,16.89 65.91,16.89 | D1.1 55.66,8.43 C5.2 55.66,6.44 57.15,4.95 57.15,4.19 | U1.16 64.77,10.39 62.25,10.39 61.59,11.05 61.59,11.04 U1.12 | v57.15,1.27 57.15,4.19 | C3.+ 43.18,6.35 | C4.1 57.15,4.19
  Top 0.406: v65.66,21.97 63.25,19.56 63.25,17.55 | 64.77,10.39 64.77,7.62 v63.5,6.35
  Top 1.016: J2.PWR 39.34,10.07 43.18,6.35 v45.85,6.35 v46.99,6.35
  Bottom 0.813: v57.15,1.27 63.5,1.27 | 63.5,1.27 66.04,1.27 | 66.04,1.27 78.74,1.27 81.28,3.81 81.28,21.59 85.09,25.4 U4.VIN | v65.66,21.97 68.07,21.97 68.07,2.54 66.04,1.27 | 63.5,1.27 v63.5,6.35
  Bottom 1.016: v57.15,1.27 48.26,1.27 46.99,2.54 v46.99,6.35 | v45.85,6.35 46.48,6.35

### Text on the board
tNames: S1 | S2 | U4 | U3 | S4 | S3